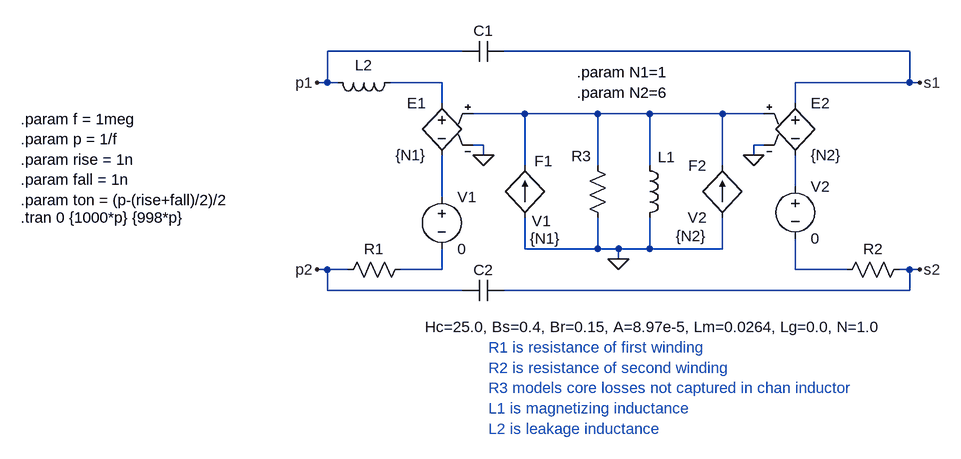
[diagram p0: schematic transformer model picture.asc]
transformer model picture.asc, the LTspice schematic file:
Version 4
SHEET 1 948 680
WIRE -16 -32 -224 -32
WIRE 672 -32 48 -32
WIRE -224 16 -224 -32
WIRE -224 16 -240 16
WIRE -208 16 -224 16
WIRE -48 16 -128 16
WIRE 672 16 672 -32
WIRE 672 16 496 16
WIRE 688 16 672 16
WIRE -48 48 -48 16
WIRE 496 48 496 16
WIRE 80 64 0 64
WIRE 192 64 80 64
WIRE 272 64 192 64
WIRE 384 64 272 64
WIRE 448 64 384 64
WIRE 16 112 0 112
WIRE 448 112 432 112
WIRE 16 128 16 112
WIRE 432 128 432 112
WIRE 80 144 80 64
WIRE 192 144 192 64
WIRE 272 144 272 64
WIRE 384 144 384 64
WIRE 496 176 496 128
WIRE -48 192 -48 128
WIRE 80 272 80 224
WIRE 192 272 192 224
WIRE 192 272 80 272
WIRE 224 272 192 272
WIRE 272 272 272 224
WIRE 272 272 224 272
WIRE 384 272 384 224
WIRE 384 272 272 272
WIRE 224 288 224 272
WIRE -224 304 -240 304
WIRE -192 304 -224 304
WIRE -48 304 -48 272
WIRE -48 304 -112 304
WIRE 496 304 496 256
WIRE 576 304 496 304
WIRE 672 304 656 304
WIRE 688 304 672 304
WIRE -224 336 -224 304
WIRE -16 336 -224 336
WIRE 672 336 672 304
WIRE 672 336 48 336
FLAG 224 288 0
FLAG 16 128 0
FLAG 432 128 0
FLAG -240 16 p1
FLAG -240 304 p2
FLAG 688 16 s1
FLAG 688 304 s2
SYMBOL ind 256 128 R0
WINDOW 3 -330 264 Left 2
WINDOW 0 29 3 Left 2
SYMATTR Value Hc=25.0, Bs=0.4, Br=0.15, A=8.97e-5, Lm=0.0264, Lg=0.0, N=1.0
SYMATTR InstName L1
SYMBOL f 80 224 R180
WINDOW 0 -43 87 Left 2
WINDOW 3 -40 -5 Left 2
WINDOW 123 -55 -32 Left 2
SYMATTR InstName F1
SYMATTR Value V1
SYMATTR Value2 {N1}
SYMBOL f 384 224 R180
WINDOW 0 24 80 Left 2
WINDOW 3 24 0 Left 2
WINDOW 123 24 -28 Left 2
SYMATTR InstName F2
SYMATTR Value V2
SYMATTR Value2 {N2}
SYMBOL e -48 32 M0
SYMATTR InstName E1
SYMATTR Value {N1}
SYMBOL e 496 32 R0
SYMATTR InstName E2
SYMATTR Value {N2}
SYMBOL voltage -48 176 R0
SYMATTR InstName V1
SYMATTR Value 0
SYMBOL voltage 496 160 R0
SYMATTR InstName V2
SYMATTR Value 0
SYMBOL res -96 288 R90
WINDOW 0 0 56 VBottom 2
WINDOW 3 32 56 Invisible 2
SYMATTR InstName R1
SYMATTR Value 46m
SYMBOL res 672 288 R90
WINDOW 0 0 56 VBottom 2
WINDOW 3 32 56 Invisible 2
SYMATTR InstName R2
SYMATTR Value 0.6m
SYMBOL res 208 240 R180
WINDOW 0 26 111 Left 2
WINDOW 3 36 40 Invisible 2
SYMATTR InstName R3
SYMATTR Value 218
SYMBOL ind -112 0 R90
WINDOW 0 5 56 VBottom 2
WINDOW 3 32 56 Invisible 2
SYMATTR InstName L2
SYMATTR Value 2.66n
SYMBOL cap 48 -48 R90
WINDOW 0 0 32 VBottom 2
WINDOW 3 32 32 Invisible 2
SYMATTR InstName C1
SYMBOL cap 48 320 R90
WINDOW 0 0 32 VBottom 2
WINDOW 3 32 32 Invisible 2
SYMATTR InstName C2
TEXT 160 0 Left 2 !.param N1=1\n.param N2=6
TEXT -696 224 Left 2 !.tran 0 {1000*p} {998*p}
TEXT -696 72 Left 2 !.param f = 1meg\n.param p = 1/f\n.param rise = 1n\n.param fall = 1n\n.param ton = (p-(rise+fall)/2)/2
TEXT 24 424 Left 2 ;R1 is resistance of first winding\nR2 is resistance of second winding\nR3 models core losses not captured in chan inductor\nL1 is magnetizing inductance\nL2 is leakage inductance

The netlist it stands for:
* transformer model picture.asc
L1 N002 0 Hc=25.0, Bs=0.4, Br=0.15, A=8.97e-5, Lm=0.0264, Lg=0.0, N=1.0
F1 0 N002 V1 {N1}
F2 0 N002 V2 {N2}
E1 N001 N004 N002 0 {N1}
E2 s1 N003 N002 0 {N2}
V1 N004 N005 0
V2 N003 N006 0
R1 N005 p2 46m
R2 s2 N006 0.6m
R3 0 N002 218
L2 N001 p1 2.66n
C1 s1 p1 C
C2 s2 p2 C
.param N1=1
.param N2=6
.tran 0 {1000*p} {998*p}
.param f = 1meg
.param p = 1/f
.param rise = 1n
.param fall = 1n
.param ton = (p-(rise+fall)/2)/2
* R1 is resistance of first winding
* R2 is resistance of second winding
* R3 models core losses not captured in chan inductor
* L1 is magnetizing inductance
* L2 is leakage inductance
.backanno
.end